# EAGLE design battery_buzzer (EAGLE 7.4.0)
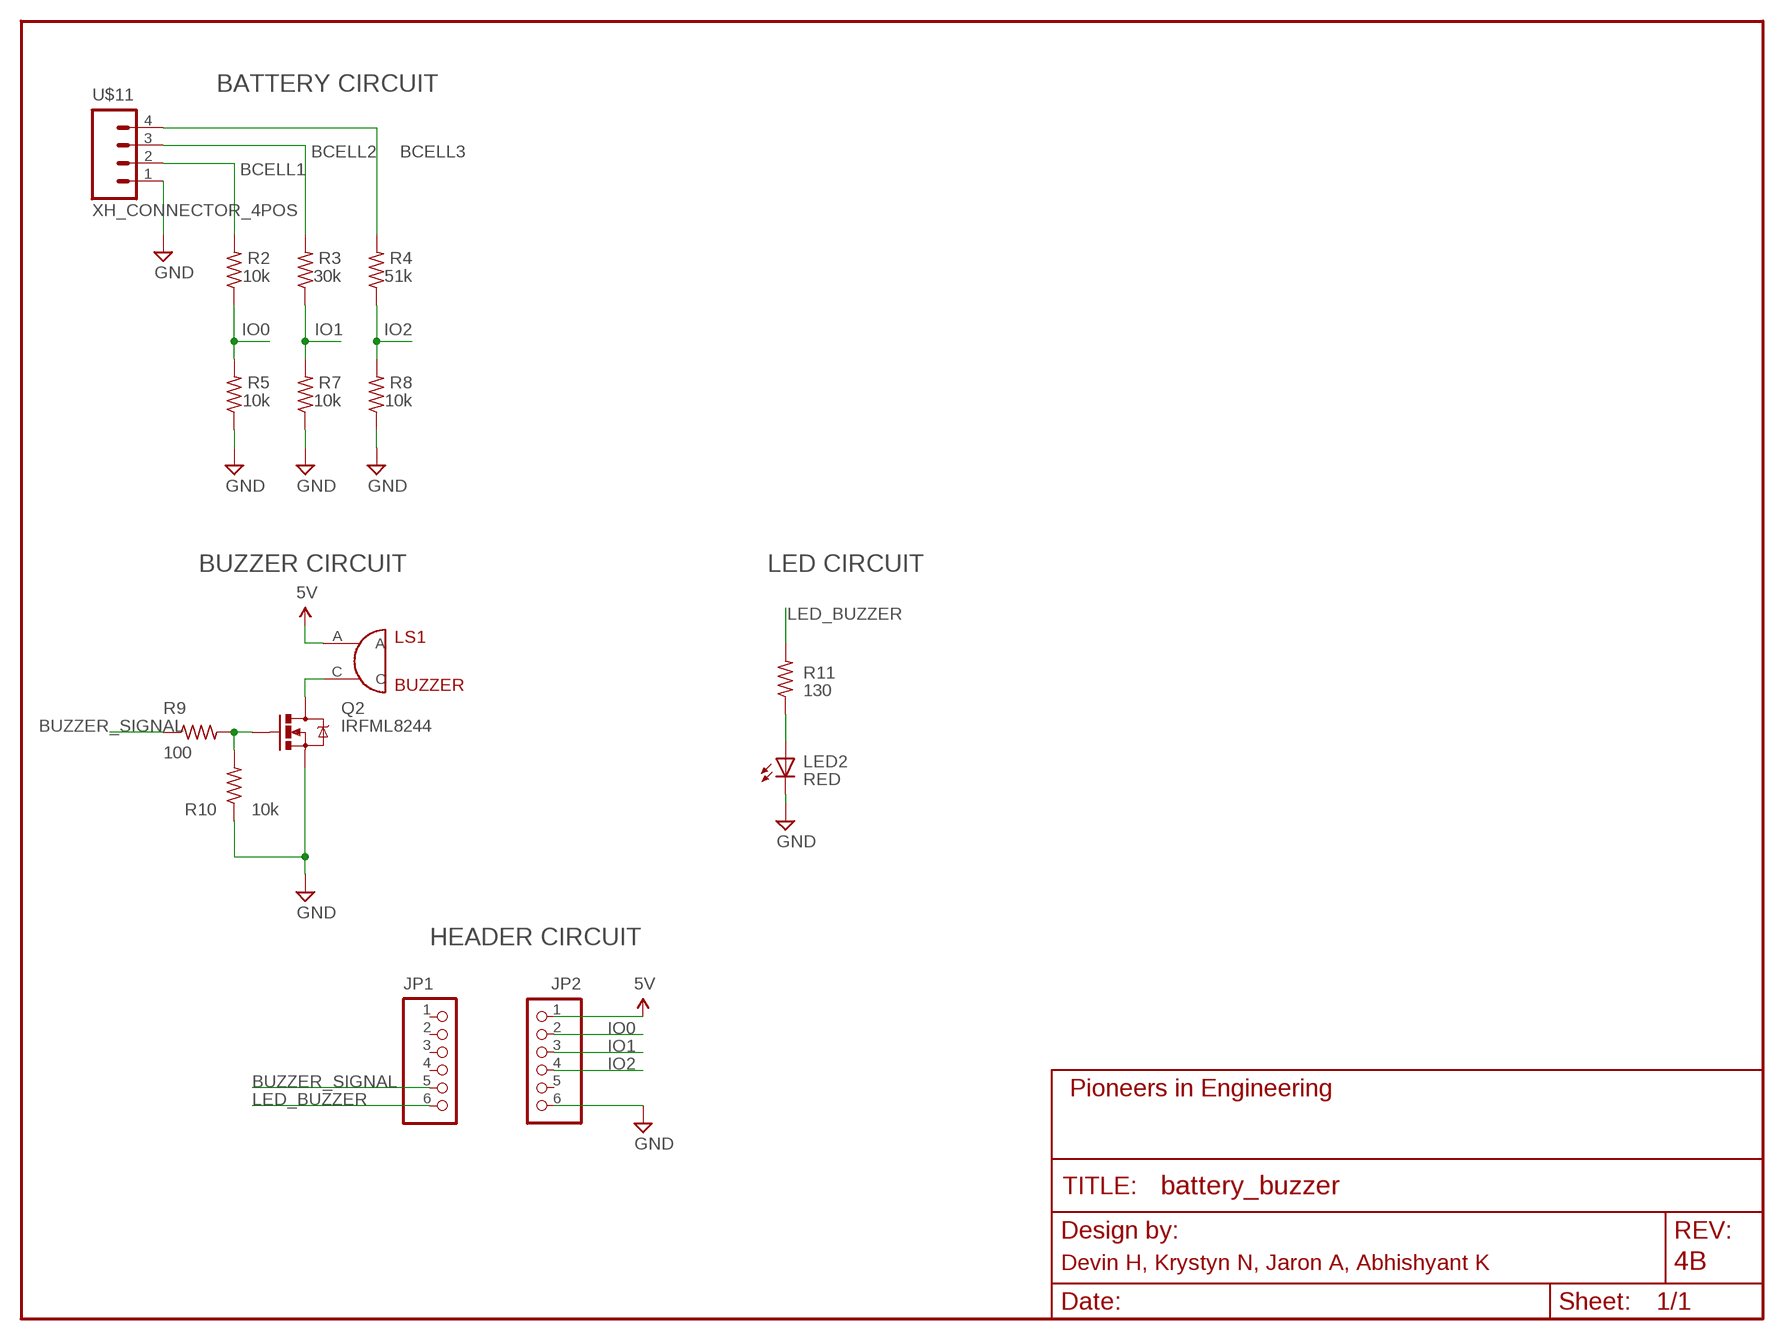
[diagram p0: schematic, sheet 1]
FRAME1 (FRAME-LETTER): AUTHOR: Devin H, Krystyn N, Jaron A, Abhishyant K; REVISION: 4B

## Parts
JP1  PINHD-1X6  [1X06]
JP2  PINHD-1X6  [1X06]
LED2  RED  LED0805  [LED-0805]
LS1  BUZZER  [BUZZER_MAGNETIC_5V_12MM_RADIAL]
Q2  IRFML8244  MOSFET-NCHANNELSMD  [SOT23-3]
R2  10k  R-US_R0603  [R0603]
R3  30k  R-US_R0603  [R0603]
R4  51k  R-US_R0603  [R0603]
R5  10k  R-US_R0603  [R0603]
R7  10k  R-US_R0603  [R0603]
R8  10k  R-US_R0603  [R0603]
R9  100  R-US_R0603  [R0603]
R10  10k  R-US_R0603  [R0603]
R11  130  R-US_R0603  [R0603]
U$11  XH_CONNECTOR_4POS  [XH_CONNECTOR_4POS_2.5MM]

## Nets
5V: JP2.1 LS1.A
BCELL1: R2.2 U$11.2
BCELL2: R3.2 U$11.3
BCELL3: R4.2 U$11.4
BUZZER_SIGNAL: JP1.5 R9.1
GND: JP2.6 LED2.C Q2.2(S) R5.1 R7.1 R8.1 R10.1 U$11.1
IO0: JP2.2 R2.1 R5.2
IO1: JP2.3 R3.1 R7.2
IO2: JP2.4 R4.1 R8.2
LED_BUZZER: JP1.6 R11.2
N$5: LS1.C Q2.3(D)
N$6: Q2.1(G) R9.2 R10.2
N$7: LED2.A R11.1
Unconnected: JP1.1 JP1.2 JP1.3 JP1.4 JP2.5

## Notes on the sheet
- BATTERY CIRCUIT
- BUZZER CIRCUIT | LED CIRCUIT
- HEADER CIRCUIT

## Library data of the parts
JP1 JP2 = pie:PINHD-1X6: 6-pin 0.1-inch header; PARTNUMBER: 965
LED2 = pie:LED: LEDs Standard schematic elements and footprints for 5mm, 3mm, 1206, and 0603 sized LEDs. 5mm - Spark Fun Electronics SKU : COM-00529 (and others); PIE-INT-REF-NUM: LED
LS1 = pie:BUZZER: Buzzer; PIE-INT-REF-NUM: BUZZER; PIE_DIGIKEY-PN: 102-1269-ND
Q2 = pie:MOSFET-NCHANNEL: N-Type MOSFET, SOT23-3 Package; PIE-INT-REF-NUM: NMOS
R2-R5 R7-R11 = pie:R-US_: RESISTOR, American symbol; PIE-INT-REF-NUM: RESISTOR-GENERIC
U$11 = pie:XH_CONNECTOR_4POS: 4-pin XH connector (through-hole type shrouded header); PIE-INT-REF-NUM: XH-4POS; PIE_DIGIKEY-PN: 455-2249-ND

## Board
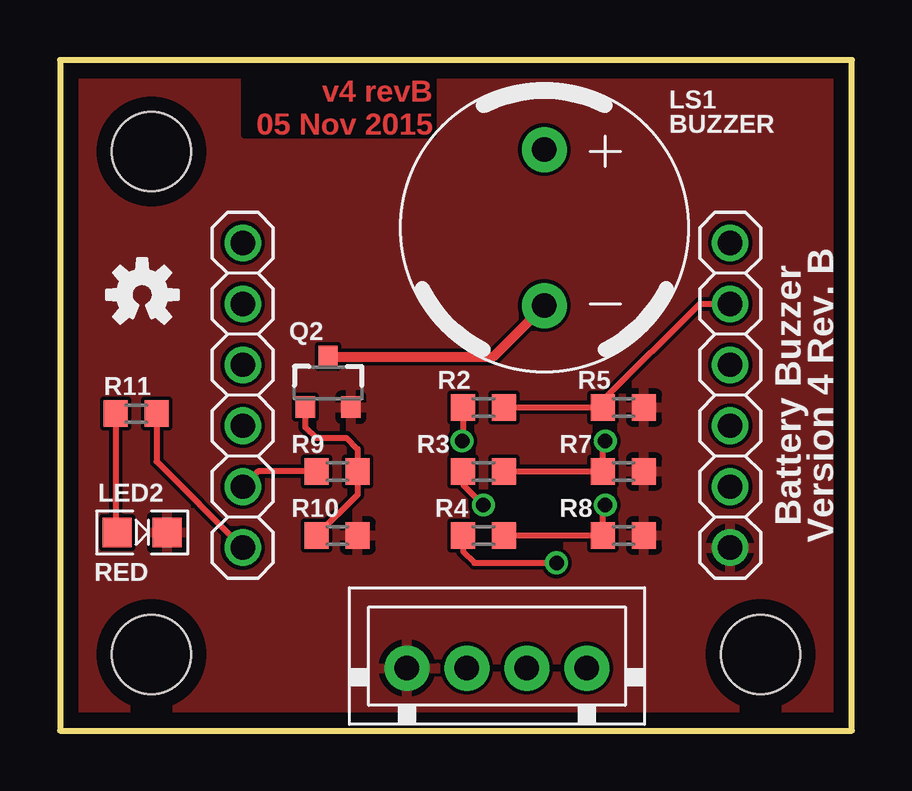
[diagram p1: board, top side]
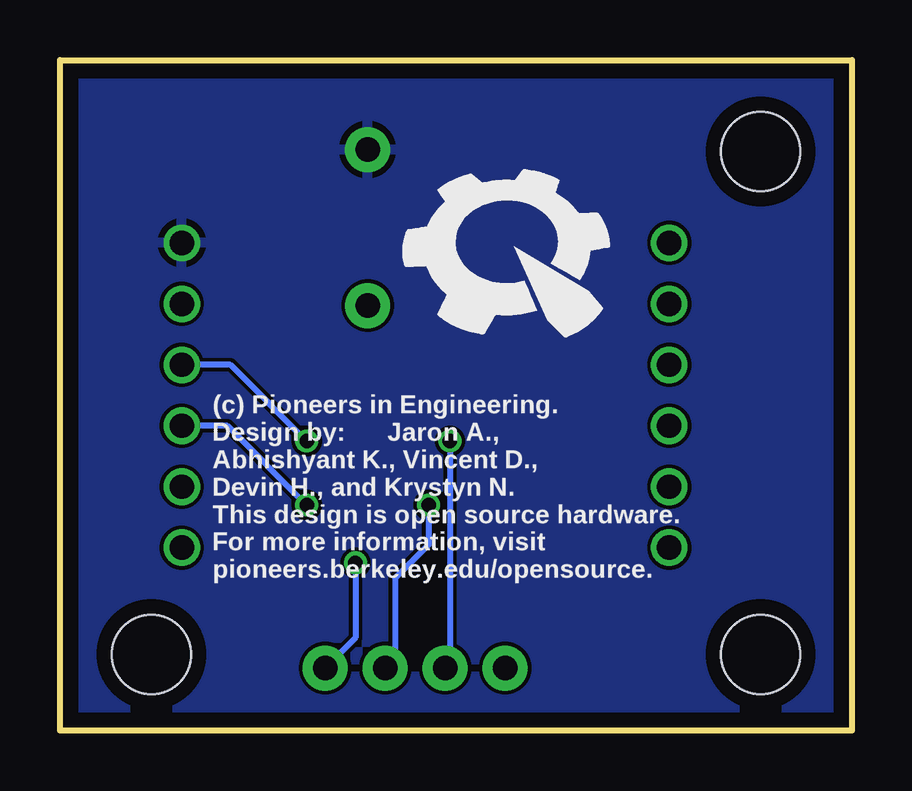
[diagram p2: board, bottom side, seen from below]

Size 33.02 x 27.94 mm. Coordinates in mm from the lower left corner, seen from the top.
Outline: 0,0 33.02,0 33.02,27.94 0,27.94 0,0
Copper layers (1*16): Top 2mil / dielectric 9mil / Bottom 2mil
Design rules "advancedcircuits-33each-pie": minimum track width 6mil, minimum drill 15mil, track to track 6mil, track to pad 6mil, pad to pad 6mil, via to via 6mil, smd to smd 6mil, copper to edge 25mil, drill to drill 7mil, minimum pad ring 7mil, minimum via ring 7mil, stop-mask expansion 3mil, vias tented up to drill 21mil, thermal gap 10mil

### Footprints (pad centres in the part's own frame; a part is rotated, then mirrored left to right if it is on the bottom)
1X06 = drill 1.016 pad 1.524: 1 -6.35,0; 2 -3.81,0; 3 -1.27,0; 4 1.27,0; 5 3.81,0; 6 6.35,0
LED-0805 = smd 1.194 x 1.245: A -1.041,0; C 1.041,0
BUZZER_MAGNETIC_5V_12MM_RADIAL = drill 1.016 pad 1.88: A 0,3.25; C 0,-3.25
SOT23-3 = smd 0.8 x 0.9: 1 -0.95,-1; 2 0.95,-1; 3 0,1.1
R0603 = smd 1 x 1.1: 1 -0.85,0; 2 0.85,0
STAND-OFF = hole 3.302: 0,0
XH_CONNECTOR_4POS_2.5MM = drill 1.016 pad 1.88: 1 -3.95,-0.19; 2 -1.45,-0.19; 3 1.05,-0.19; 4 3.55,-0.19

### Placement (x,y rotation side)
JP1  7.62,13.97 270 top
JP2  27.94,13.97 270 top
LED2  3.43,8.26 0 top
LS1  20.19,20.95 0 top
Q2  11.18,14.48 0 top
R2  17.65,13.46 180 top
R3  17.65,10.79 180 top
R4  17.65,8.13 180 top
R5  23.5,13.46 180 top
R7  23.5,10.79 180 top
R8  23.5,8.13 180 top
R9  11.56,10.79 0 top
R10  11.56,8.13 180 top
R11  3.17,13.21 0 top
U$1  [PIE-LOGO-SMALL]  14.1,20.19 0 bottom
U$2  [STAND-OFF]  3.81,24.13 0 top
U$4  [STAND-OFF]  3.81,3.17 0 top
U$7  [OSHW-LOGO-S]  3.43,18.16 0 top
U$11  18.41,2.79 0 top
U$17  [STAND-OFF]  29.21,3.17 0 top

### Tracks (layer width: path | path; a pad name or v marks a point on that pad's centre or on a via)
5V
  pour Bottom: 0,0 0,27.94 33.02,27.94 33.02,0
BCELL1  (via drill 0.6)
  Top 0.254: R2.2 16.8,12.1 v16.76,12.06
  Bottom 0.254: v16.76,12.06 16.76,2.81 U$11.2
BCELL2  (via drill 0.6)
  Top 0.254: R3.2 16.8,10.25 v17.65,9.4
  Bottom 0.254: v17.65,9.4 17.65,7.75 19.05,6.35 19.05,3.02 U$11.3
BCELL3  (via drill 0.6)
  Top 0.254: R4.2 16.8,7.45 17.27,6.99 v20.7,6.99
  Bottom 0.254: v20.7,6.99 20.7,3.87 U$11.4
BUZZER_SIGNAL
  Top 0.254: R9.1 8.26,10.79 JP1.5
GND
  pour Top: 0,0 0,27.94 33.02,27.94 33.02,0
IO0
  Top 0.254: R2.1 R5.2 22.64,13.76 26.67,17.78 JP2.2
IO1  (via drill 0.6)
  Top 0.254: R3.1 R7.2 22.64,11.98 v22.73,12.06
  Bottom 0.254: v22.73,12.06 25.91,15.24 JP2.3
IO2  (via drill 0.6)
  Top 0.254: R4.1 R8.2 22.64,9.31 v22.73,9.4
  Bottom 0.254: v22.73,9.4 26.04,12.7 JP2.4
LED_BUZZER
  Top 0.254: R11.2 4.03,11.21 JP1.6
N$5
  Top 0.406: Q2.3 18.07,15.58 LS1.C
N$6
  Top 0.254: R10.2 12.41,9.83 R9.2 12.41,11.72 11.94,12.19 10.67,12.19 10.23,12.63 Q2.1
N$7
  Top 0.254: R11.1 2.33,8.32 LED2.A

### Text on the board
Top: v4 revB / 05 Nov 2015
tPlace: Battery Buzzer / Version 4 Rev. B
bPlace: (c) Pioneers in Engineering. / Design by: Jaron A., / Abhishyant K., Vincent D., / Devin H., and Krystyn N. / This design is open source hardware. / For more information, visit / pioneers.berkeley.edu/opensource.